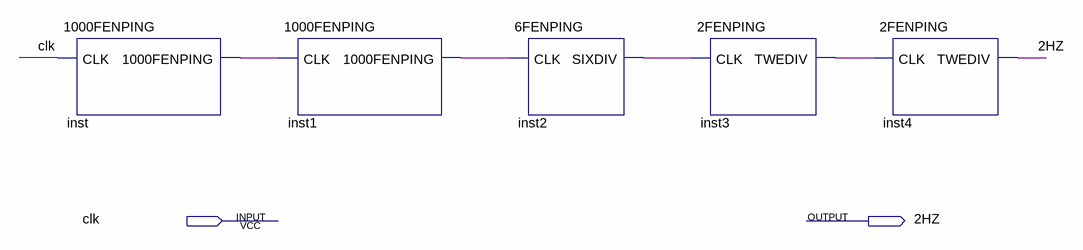
[diagram p0: schematic sheet]
// Quartus schematic 2HZ.bdf as structural Verilog: 5 symbols, 2 pins
module \2HZ  (
  input  clk,
  output \2HZ 
);

  wire inst1_1000fenping, inst2_sixdiv, inst3_twediv, inst_1000fenping;

  \1000FENPING  inst (.CLK(clk), .\1000FENPING (inst_1000fenping));
  \1000FENPING  inst1 (.CLK(inst_1000fenping), .\1000FENPING (inst1_1000fenping));
  \6FENPING  inst2 (.CLK(inst1_1000fenping), .SIXDIV(inst2_sixdiv));
  \2FENPING  inst3 (.CLK(inst2_sixdiv), .TWEDIV(inst3_twediv));
  \2FENPING  inst4 (.CLK(inst3_twediv), .TWEDIV(\2HZ ));
endmodule
